# EAGLE design TSOC_CYBLE_R1_0 (EAGLE 6.6.0)
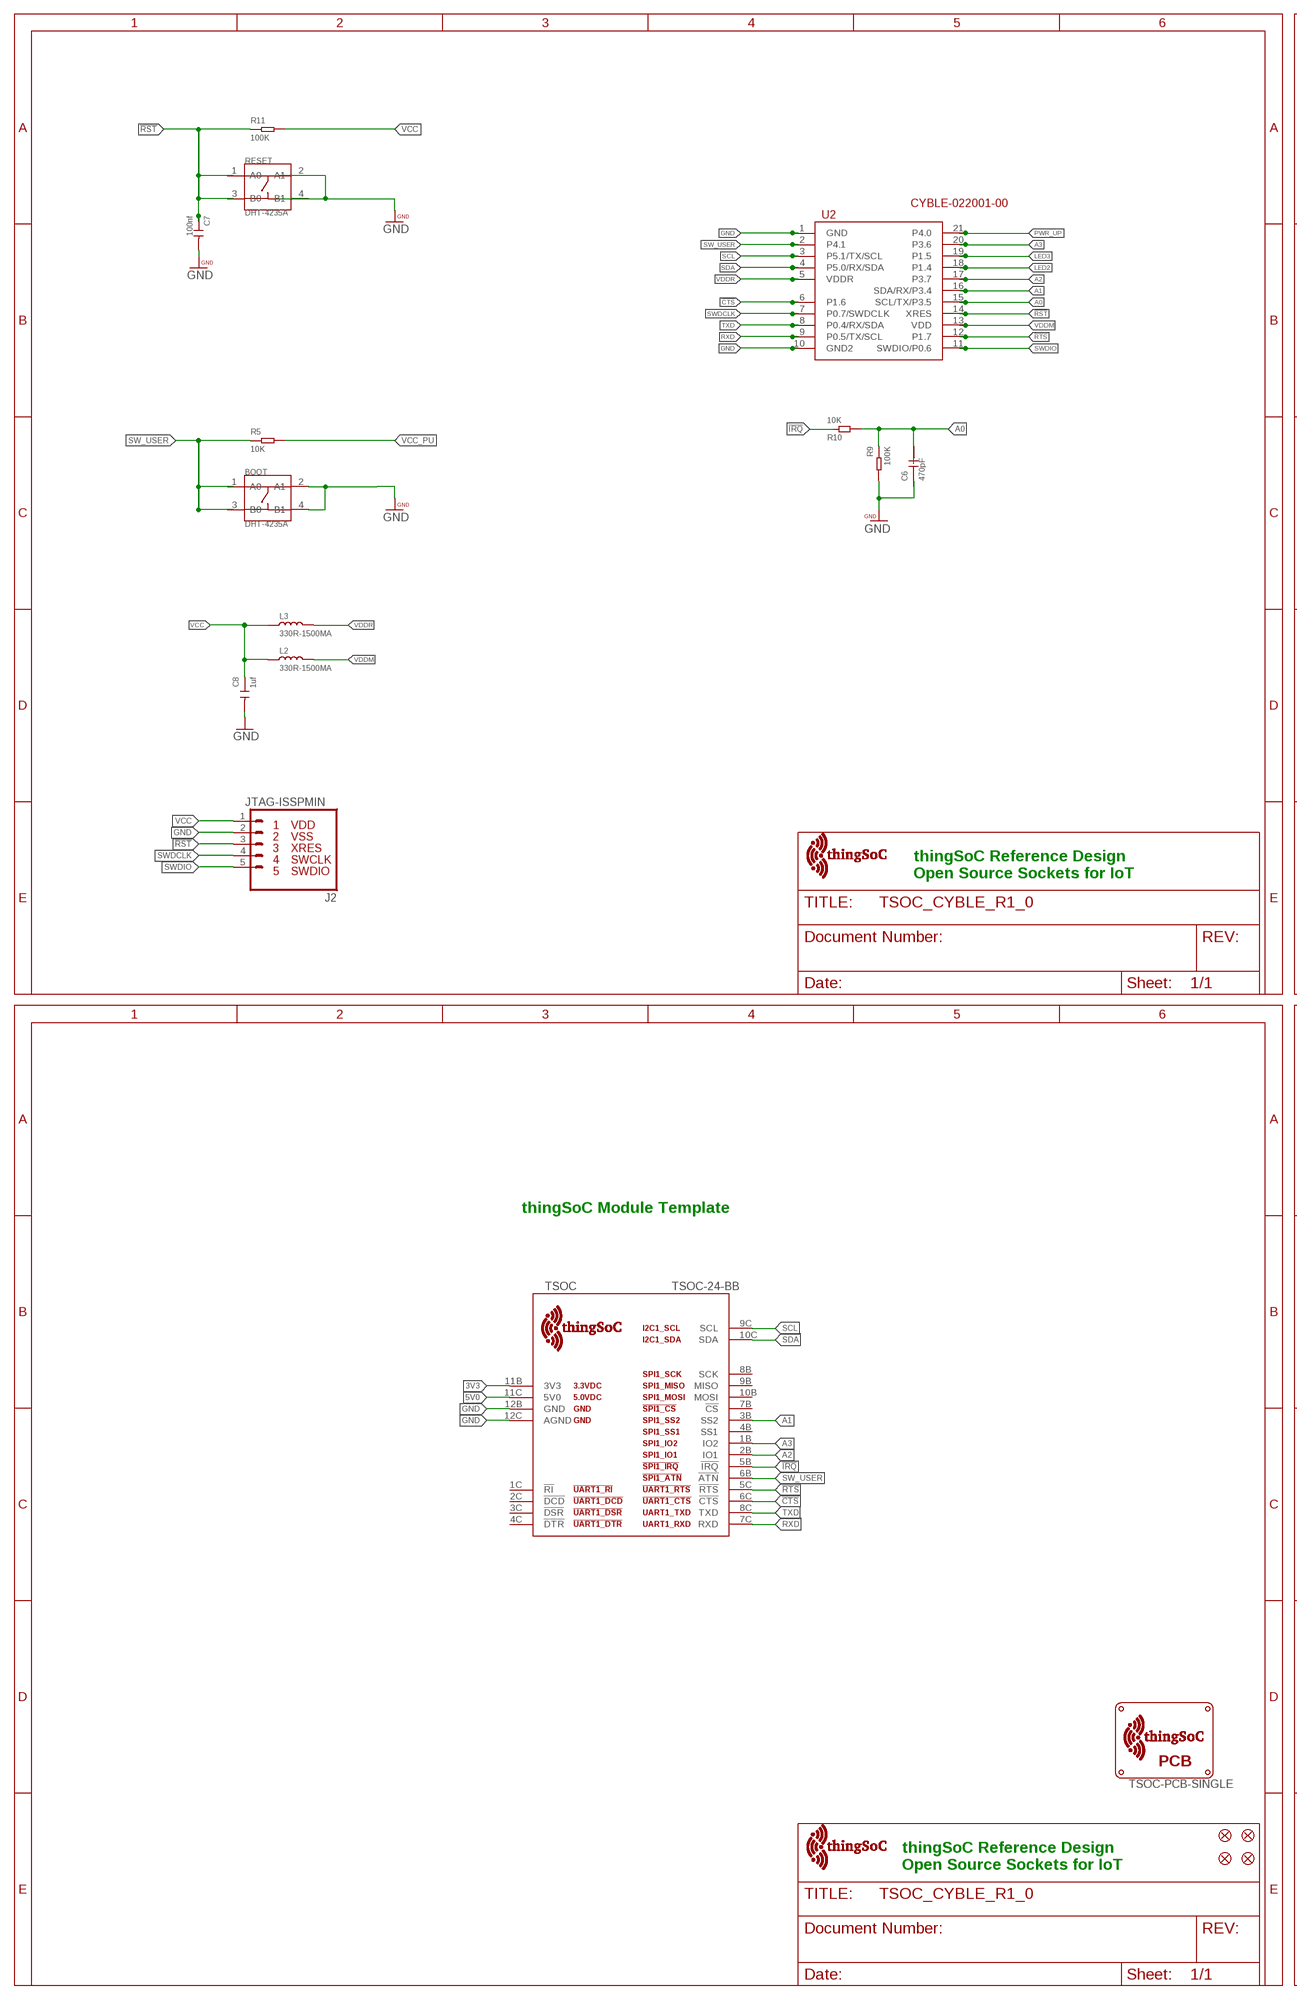
[diagram p0: schematic, sheet 1, part 1 of 2]
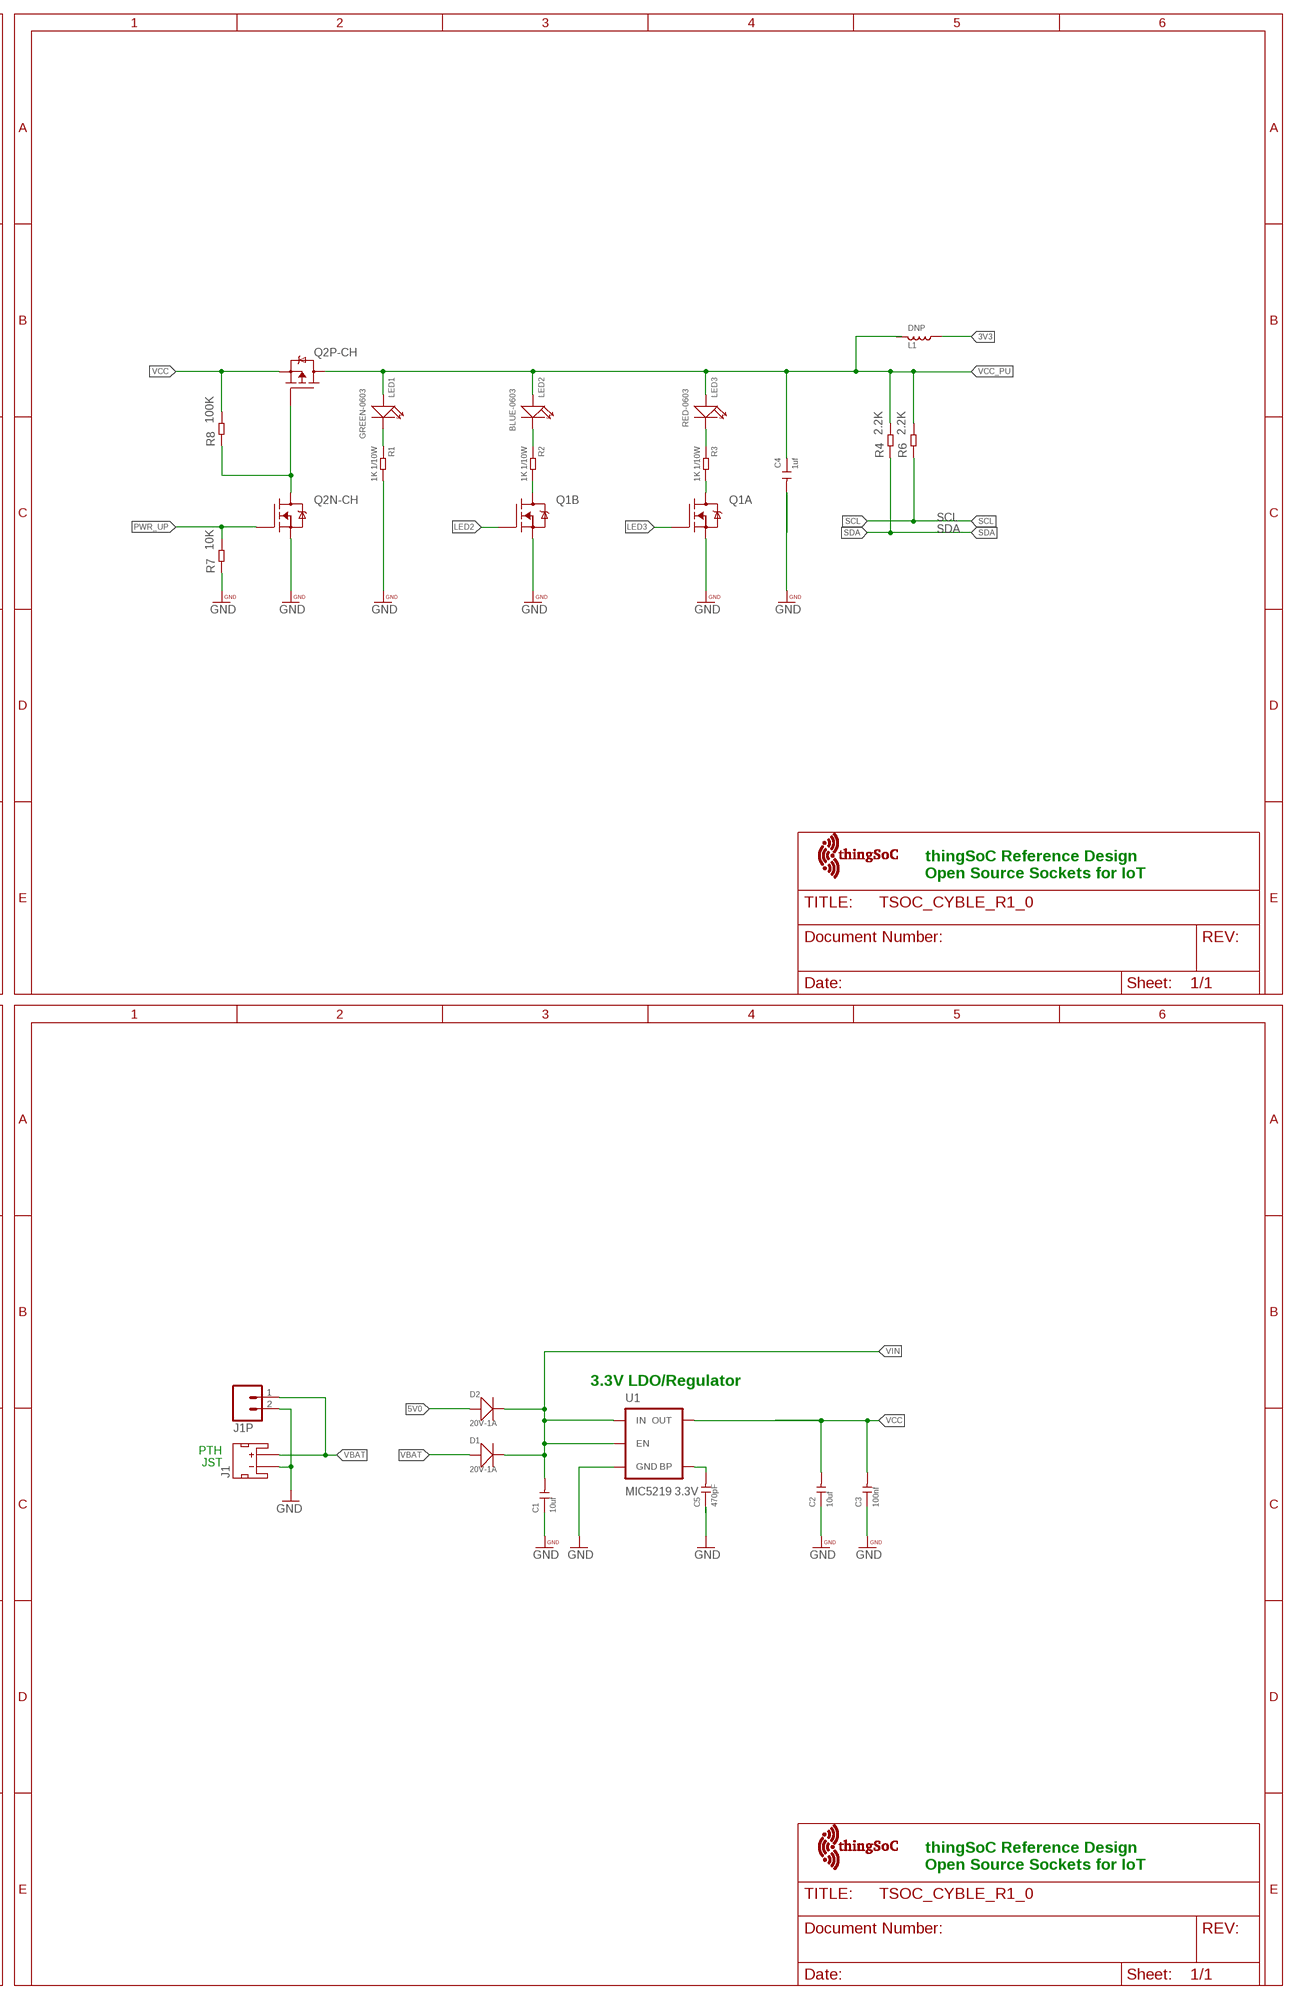
[diagram p1: schematic, sheet 1, part 2 of 2]

## Parts
$$U$1  TSOC-LOGO-MED  [TSOC-LOGO-MED]
$$U$2  TSOC-LOGO-MED  [TSOC-LOGO-MED]
BOOT  DHT-4235A  SMD-BUTTON-TOP-DHT-4235A(4P-4.2X3.2MM)  [SW4-SMD-4.2X3.2X2.5MM]
C1  10uf  CERAMIC-10UF-25V-10%-X5R(1206)  [C1206]
C2  10uf  CERAMIC-10UF-25V-10%-X5R(1206)  [C1206]
C3  100nf  CERAMIC-100NF-50V-10%-X7R(0603)  [C0603]
C4  1uf  CERAMIC-1UF-25V-10%-X7R(0603)  [C0603]
C5  470pF  CERAMIC-100NF-50V-10%-X7R(0603)  [C0603]
C6  470pF  CERAMIC-100NF-50V-10%-X7R(0603)  [C0603]
C7  100nf  CERAMIC-100NF-50V-10%-X7R(0603)  [C0603]
C8  1uf  CERAMIC-1UF-25V-10%-X7R(0603)  [C0603]
D1  20V-1A  SMD-DIODE-SCHOTTKY-20V-1A(SOD-123)  [SOD-123]
D2  20V-1A  SMD-DIODE-SCHOTTKY-20V-1A(SOD-123)  [SOD-123]
FID1  FIDUCIALUFIDUCIAL  [MICRO-FIDUCIAL]
FID2  FIDUCIALUFIDUCIAL  [MICRO-FIDUCIAL]
FID3  FIDUCIALUFIDUCIAL  [MICRO-FIDUCIAL]
FID4  FIDUCIALUFIDUCIAL  [MICRO-FIDUCIAL]
J1  JST_2MM_MALE  [JST-2-SMD]
J1P  M02-JST-2-PTH-NO_SILK  [JST-2-PTH-NS]
J2  JTAG-ISSPMIN  [PSOC_JTAG_MINSILK]
L1  DNP  SMD-FERRITE-CHIP-120-OHM-500MA(0603)  [L0603]
L2  330R-1500MA  SMD-FERRITE-BEAD-330R-1500MA(0805)'0805'  [L0805]
L3  330R-1500MA  SMD-FERRITE-BEAD-330R-1500MA(0805)'0805'  [L0805]
LED1  GREEN-0603  SMD-LED-CLEAR-GREEN(0603)  [LED-0603]
LED2  BLUE-0603  SMD-LED-CLEAR-GREEN(0603)  [LED-0603]
LED3  RED-0603  LED-SMD-RED-DIFFUSED(0603)  [LED-0603]
PCB  TSOC-PCB-SINGLE  [TSOC-BB-BRD-DIM]
Q1  FDG1024NZ  [SOT95P280X110-6N]
Q2  FDC6420C  [SOT95P280X110-6N]
R1  1K 1/10W  SMD-RES-1K-5%-1/10W(0603)  [R0603]
R2  1K 1/10W  SMD-RES-1K-5%-1/10W(0603)  [R0603]
R3  1K 1/10W  SMD-RES-1K-5%-1/10W(0603)  [R0603]
R4  2.2K  SMD-RES-2.2K-5%-1/10W(0603)  [R0603]
R5  10K  SMD-RES-10K-1%-1/10W(0603)  [R0603]
R6  2.2K  SMD-RES-2.2K-5%-1/10W(0603)  [R0603]
R7  10K  SMD-RES-10K-1%-1/10W(0603)  [R0603]
R8  100K  SMD-RES-10K-1%-1/10W(0603)  [R0603]
R9  100K  SMD-RES-100K-1%-1/10W(0603)  [R0603]
R10  10K  SMD-RES-100K-1%-1/10W(0603)  [R0603]
R11  100K  SMD-RES-10K-1%-1/10W(0603)  [R0603]
RESET  DHT-4235A  SMD-BUTTON-TOP-DHT-4235A(4P-4.2X3.2MM)  [SW4-SMD-4.2X3.2X2.5MM]
TSOC  TSOC-24-BB  [TSOC-BB-S24]
U1  MIC5219 3.3V  V_REG_MIC52193.3V  [SOT23-5]
U2  CYBLE-022001-00  [PROC-BLE-10MM-21]
U$100  TSOC-LOGO-MED  [TSOC-LOGO-MED]
U$101  TSOC-LOGO-MED  [TSOC-LOGO-MED]

## Nets
3V3: L1.2 TSOC.11B(3V3)
5V0: D2.+ TSOC.11C(5V0)
!CTS: TSOC.6C(!CTS) U2.6(P1.6)
!IRQ: R10.1 TSOC.5B(!IRQ)
!RST: C7.1 J2.3 R11.1 RESET.1(A0) RESET.3(B0) U2.14(XRES)
!RTS: TSOC.5C(!RTS) U2.12(P1.7)
A0: C6.2 R9.1 R10.2 U2.15(SCL/TX/P3.5)
A1: TSOC.3B(SS2) U2.16(SDA/RX/P3.4)
A2: TSOC.2B(IO1) U2.17(P3.7)
A3: TSOC.1B(IO2) U2.20(P3.6)
BYPASS1: C5.2 U1.4(BP)
GATE: Q2.3(P-CH:G) Q2.6(N-CH:D) R8.1
GND: BOOT.2(A1) BOOT.4(B1) C1.1 C2.1 C3.1 C4.2 C5.1 C6.1 C7.2 C8.2 J1.1(-) J1P.2 J2.2 Q1.1(A:S) Q1.4(B:S) Q2.5(N-CH:S) R1.2 R7.1 R9.2 RESET.2(A1) RESET.4(B1) TSOC.12B(GND) TSOC.12C(AGND) U1.2(GND) U2.1(GND) U2.10(GND2)
L2: Q1.3(B:D) R2.2
L3: Q1.6(A:D) R3.2
LD1: LED1.- R1.1
LD2: LED2.- R2.1
LD3: LED3.- R3.1
LED2: Q1.5(B:G) U2.18(P1.4)
LED3: Q1.2(A:G) U2.19(P1.5)
PWR_UP: Q2.1(N-CH:G) R7.2 U2.21(P4.0)
RXD: TSOC.7C(RXD) U2.9(P0.5/TX/SCL)
SCL: R6.1 TSOC.9C(SCL) U2.3(P5.1/TX/SCL)
SDA: R4.1 TSOC.10C(SDA) U2.4(P5.0/RX/SDA)
SW_USER: BOOT.1(A0) BOOT.3(B0) R5.1 TSOC.6B(!ATN) U2.2(P4.1)
SWDCLK: J2.4 U2.7(P0.7/SWDCLK)
SWDIO: J2.5 U2.11(SWDIO/P0.6)
TXD: TSOC.8C(TXD) U2.8(P0.4/RX/SDA)
VBAT: D1.+ J1.2(+) J1P.1
VCC: C2.2 C3.2 C8.1 J2.1 L2.1 L3.1 Q2.2(P-CH:S) R8.2 R11.2 U1.5(OUT)
VCC_PU: C4.1 L1.1 LED1.+ LED2.+ LED3.+ Q2.4(P-CH:D) R4.2 R5.2 R6.2
VDDM: L2.2 U2.13(VDD)
VDDR: L3.2 U2.5(VDDR)
VIN: C1.2 D1.- D2.- U1.1(IN) U1.3(EN)
Unconnected: J1.NC1(PAD1) J1.NC2(PAD2) TSOC.1C(!RI) TSOC.2C(!DCD) TSOC.3C(!DSR) TSOC.4B(SS1) TSOC.4C(!DTR) TSOC.7B(!CS) TSOC.8B(SCK) TSOC.9B(MISO) TSOC.10B(MOSI)

## Notes on the sheet
- thingSoC Reference Design
  Open Source Sockets for IoT
- thingSoC Reference Design
  Open Source Sockets for IoT
- thingSoC Module Template
- 3.3V LDO/Regulator
- PTH
   JST
- thingSoC Reference Design
  Open Source Sockets for IoT
- thingSoC Reference Design
  Open Source Sockets for IoT

## Library data of the parts
$$U$1 $$U$2 U$100 U$101 = thingSoC:TSOC-LOGO: thingSoC Logo Source LBR : http://www.thingsoc.com Github : https://github.com/thingsoc License : http://creativecommons.org/licenses/by-sa/4.0/ (Creative Commons 4.0) THIS SOFTWARE IS PROVIDED BY THE CONTRIBUTORS "AS IS" AND WITHOUT ANY EXPRESS OR IMPLIED WARRANTIES, INCLUDING, BUT NOT LIMITED TO, THE IMPLIED WARRANTIES OF MERCHANTABILITY AND FITNESS FOR A PARTICULAR PURPOSE ARE DISCLAIMED. IN NO EVENT SHALL THE COPYRIGHT OWNER OR CONTRIBUTORS BE LIABLE FOR ANY DIRECT, INDIRECT, INCIDENTAL, SPECIAL, EXEMPLARY, OR CONSEQUENTIAL DAMAGES (INCLUDING, BUT NOT LIMITED TO, PROCUREMENT OF SUBSTITUTE GOODS OR SERVICES; LOSS OF USE, DATA, OR PROFITS; OR BUSINESS INTERRUPTION) HOWEVER CAUSED AND ON ANY THEORY OF LIABILITY, WHETHER IN CONTRACT, STRICT LIABILITY, OR TORT (INCLUDING NEGLIGENCE OR OTHERWISE) ARISING IN ANY WAY OUT OF THE USE OF THIS SOFTWARE, EVEN IF ADVISED OF THE POSSIBILITY OF SUCH DAMAGE.
BOOT RESET = TSOC_GROVEY_WIFI:SMD-BUTTON-TOP-DHT-4235A(4P-4.2X3.2MM): 311020045; MPN: DHT-4235A
C1 C2 = Seeed-Capacitor-2016:CERAMIC-10UF-25V-10%-X5R(1206): 302010181; MPN: CC1206KKX5R8BB106
C3 C7 = Seeed-Capacitor-2016:CERAMIC-100NF-50V-10%-X7R(0603): 302010138; MPN: CC0603KRX7R9BB104
C4 C8 = Seeed-Capacitor-2016:CERAMIC-1UF-25V-10%-X7R(0603): 302010139; MPN: CC0603KRX7R8BB105
C5 C6 = Seeed-Capacitor-2016:CERAMIC-100NF-50V-10%-X7R(0603): 302010138; MPN: CC0603KRX7R9BB104; VALUE: 100nf
D1 D2 = Seeed-Diode-2016:SMD-DIODE-SCHOTTKY-20V-1A(SOD-123): 304020034; MPN: B5819W
FID1-FID4 = TSOC-ESP8266-BASE:FIDUCIAL: Fiducial Alignment Points Various fiducial points for machine vision alignment.
J1 = PatternAgents-ProtoPads:JST_2MM_MALE: Mates to single-cell LiPo batteries. CONN-11443 Now with smashable polarity marks!; BTM_NEG: -; BTM_POS: +; PROD_ID: CONN-11443; TOP_NEG: -; TOP_POS: +
J1P = TSOC-ESP8266-BASE:M02: Standard 2-pin 0.1" header. Use with - straight break away headers ( PRT-00116) - right angle break away headers (PRT-00553) - swiss pins (PRT-00743) - machine pins (PRT-00117) - female headers (PRT-00115) Molex polarized connector foot print use with: PRT-08233 with associated crimp pins and housings. 2.54_SCREWTERM for use with PRT-10571. 3.5mm Screw Terminal footprints for PRT-08084 5mm Screw Terminal footprints for use with PRT-08432
J2 = PatternAgents-Cypress:JTAG-ISSP: JTAG-ISSP Programming Connector (5 Pin ISSP JTAG Connector) LBR Source: http://www.patternagents.com THIS SOFTWARE IS PROVIDED BY THE CONTRIBUTORS "AS IS" AND WITHOUT ANY EXPRESS OR IMPLIED WARRANTIES, INCLUDING, BUT NOT LIMITED TO, THE IMPLIED WARRANTIES OF MERCHANTABILITY AND FITNESS FOR A PARTICULAR PURPOSE ARE DISCLAIMED. IN NO EVENT SHALL THE COPYRIGHT OWNER OR CONTRIBUTORS BE LIABLE FOR ANY DIRECT, INDIRECT, INCIDENTAL, SPECIAL, EXEMPLARY, OR CONSEQUENTIAL DAMAGES (INCLUDING, BUT NOT LIMITED TO, PROCUREMENT OF SUBSTITUTE GOODS OR SERVICES; LOSS OF USE, DATA, OR PROFITS; OR BUSINESS INTERRUPTION) HOWEVER CAUSED AND ON ANY THEORY OF LIABILITY, WHETHER IN CONTRACT, STRICT LIABILITY, OR TORT (INCLUDING NEGLIGENCE OR OTHERWISE) ARISING IN ANY WAY OUT OF THE USE OF THIS SOFTWARE, EVEN IF ADVISED OF THE POSSIBILITY OF SUCH DAMAGE.
L1 = Seeed-Inductor-2016:SMD-FERRITE-CHIP-120-OHM-500MA(0603): 303030001; MPN: BLM18AG121SN1D; VALUE: 120OHM-500MA
L2 L3 = Seeed-Inductor-2016:SMD-FERRITE-BEAD-330R-1500MA(0805): 303030006; MPN: BLM21PG331SN1D
LED1 = Seeed-LED-2016:SMD-LED-CLEAR-GREEN(0603): 304090043; MPN: 19-217-G7C-AN1P2-3T
LED2 = Seeed-LED-2016:SMD-LED-CLEAR-GREEN(0603): 304090043; MPN: 19-217-G7C-AN1P2-3T; VALUE: GREEN-0603
LED3 = Seeed-LED-2016:LED-SMD-RED-DIFFUSED(0603): 304090042; MPN: 19-217-R6C-AL1M2VY-3T
PCB = thingSoC:TSOC-PCB: thingSoC PCB Outlines Boards Outlines for Standard Sizes (in the DImension Layer) (Registration marks in the tDocu layer - make sure to turn on tDocu/bDocu) Source LBR : http://www.thingsoc.com Github : https://github.com/thingsoc License : http://creativecommons.org/licenses/by-sa/4.0/ (Creative Commons 4.0) THIS SOFTWARE IS PROVIDED BY THE CONTRIBUTORS "AS IS" AND WITHOUT ANY EXPRESS OR IMPLIED WARRANTIES, INCLUDING, BUT NOT LIMITED TO, THE IMPLIED WARRANTIES OF MERCHANTABILITY AND FITNESS FOR A PARTICULAR PURPOSE ARE DISCLAIMED. IN NO EVENT SHALL THE COPYRIGHT OWNER OR CONTRIBUTORS BE LIABLE FOR ANY DIRECT, INDIRECT, INCIDENTAL, SPECIAL, EXEMPLARY, OR CONSEQUENTIAL DAMAGES (INCLUDING, BUT NOT LIMITED TO, PROCUREMENT OF SUBSTITUTE GOODS OR SERVICES; LOSS OF USE, DATA, OR PROFITS; OR BUSINESS INTERRUPTION) HOWEVER CAUSED AND ON ANY THEORY OF LIABILITY, WHETHER IN CONTRACT, STRICT LIABILITY, OR TORT (INCLUDING NEGLIGENCE OR OTHERWISE) ARISING IN ANY WAY OUT OF THE USE OF THIS SOFTWARE, EVEN IF ADVISED OF THE POSSIBILITY OF SUCH DAMAGE.
Q1 = PatternAgents-Fairchild:FDG1024NZ: FDG1024NZ Dual N-Channel PowerTrench® MOSFET 20 V, 1.2 A, 175 mΩ
Q2 = PatternAgents-Fairchild:FDC6420C: N and P Channel Power Trench MOSFETs
R1-R3 = Seeed-Resistor-2016:SMD-RES-1K-5%-1/10W(0603): 301010291; MPN: RC0603JR-071KL
R4 R6 = Seeed-Resistor-2016:SMD-RES-2.2K-5%-1/10W(0603): 301010124; MPN: RC0603JR-072K2L
R5 R7 = Seeed-Resistor-2016:SMD-RES-10K-1%-1/10W(0603): 301010299; MPN: RC0603FR-0710KL
R8 R11 = Seeed-Resistor-2016:SMD-RES-10K-1%-1/10W(0603): 301010299; MPN: RC0603FR-0710KL; VALUE: 10K
R9 = Seeed-Resistor-2016:SMD-RES-100K-1%-1/10W(0603): 301010196; MPN: RC0603FR-07100KL
R10 = Seeed-Resistor-2016:SMD-RES-100K-1%-1/10W(0603): 301010196; MPN: RC0603FR-07100KL; VALUE: 100K
TSOC = thingSoC:TSOC-24: thingSoC Twenty-Four(24) Pin Socket Source LBR : http://www.thingsoc.com Github : https://github.com/thingsoc License : http://creativecommons.org/licenses/by-sa/4.0/ (Creative Commons 4.0) THIS SOFTWARE IS PROVIDED BY THE CONTRIBUTORS "AS IS" AND WITHOUT ANY EXPRESS OR IMPLIED WARRANTIES, INCLUDING, BUT NOT LIMITED TO, THE IMPLIED WARRANTIES OF MERCHANTABILITY AND FITNESS FOR A PARTICULAR PURPOSE ARE DISCLAIMED. IN NO EVENT SHALL THE COPYRIGHT OWNER OR CONTRIBUTORS BE LIABLE FOR ANY DIRECT, INDIRECT, INCIDENTAL, SPECIAL, EXEMPLARY, OR CONSEQUENTIAL DAMAGES (INCLUDING, BUT NOT LIMITED TO, PROCUREMENT OF SUBSTITUTE GOODS OR SERVICES; LOSS OF USE, DATA, OR PROFITS; OR BUSINESS INTERRUPTION) HOWEVER CAUSED AND ON ANY THEORY OF LIABILITY, WHETHER IN CONTRACT, STRICT LIABILITY, OR TORT (INCLUDING NEGLIGENCE OR OTHERWISE) ARISING IN ANY WAY OUT OF THE USE OF THIS SOFTWARE, EVEN IF ADVISED OF THE POSSIBILITY OF SUCH DAMAGE.
U1 = TSOC-ESP8266-BASE:V_REG_MIC5219: V_REG MIC5219 Standard 3.3V and 5V 500mA LDO voltage regulator in SOT-23 layout. Micrel part MIC5219. BP (by-pass) pin is used to lower output noise with 470pF cap, may be left open.; PROD_ID: VREG-09872
U2 = PatternAgents-Cypress:CYBLE-022001-00: Cypress PSoC® 4 - Programmable System on Chip, Cortex-M0 Based , Bluetooth Radio Module http://www.cypress.com/?mpn=CYBLE-022001-00 LBR Source: http://www.patternagents.com THIS SOFTWARE IS PROVIDED BY THE CONTRIBUTORS "AS IS" AND WITHOUT ANY EXPRESS OR IMPLIED WARRANTIES, INCLUDING, BUT NOT LIMITED TO, THE IMPLIED WARRANTIES OF MERCHANTABILITY AND FITNESS FOR A PARTICULAR PURPOSE ARE DISCLAIMED. IN NO EVENT SHALL THE COPYRIGHT OWNER OR CONTRIBUTORS BE LIABLE FOR ANY DIRECT, INDIRECT, INCIDENTAL, SPECIAL, EXEMPLARY, OR CONSEQUENTIAL DAMAGES (INCLUDING, BUT NOT LIMITED TO, PROCUREMENT OF SUBSTITUTE GOODS OR SERVICES; LOSS OF USE, DATA, OR PROFITS; OR BUSINESS INTERRUPTION) HOWEVER CAUSED AND ON ANY THEORY OF LIABILITY, WHETHER IN CONTRACT, STRICT LIABILITY, OR TORT (INCLUDING NEGLIGENCE OR OTHERWISE) ARISING IN ANY WAY OUT OF THE USE OF THIS SOFTWARE, EVEN IF ADVISED OF THE POSSIBILITY OF SUCH DAMAGE.

## Net classes
1 vcc: width 0.254 mm

## Board
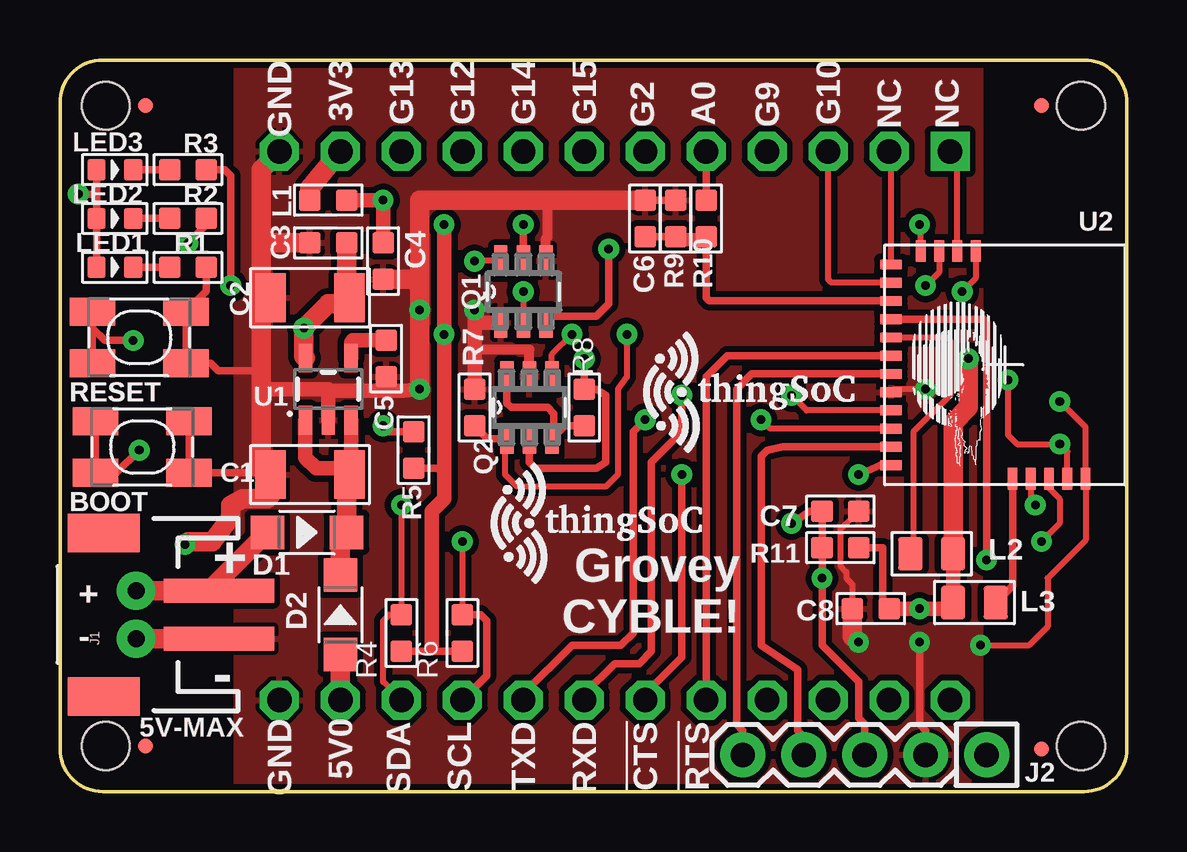
[diagram p2: board, top side]
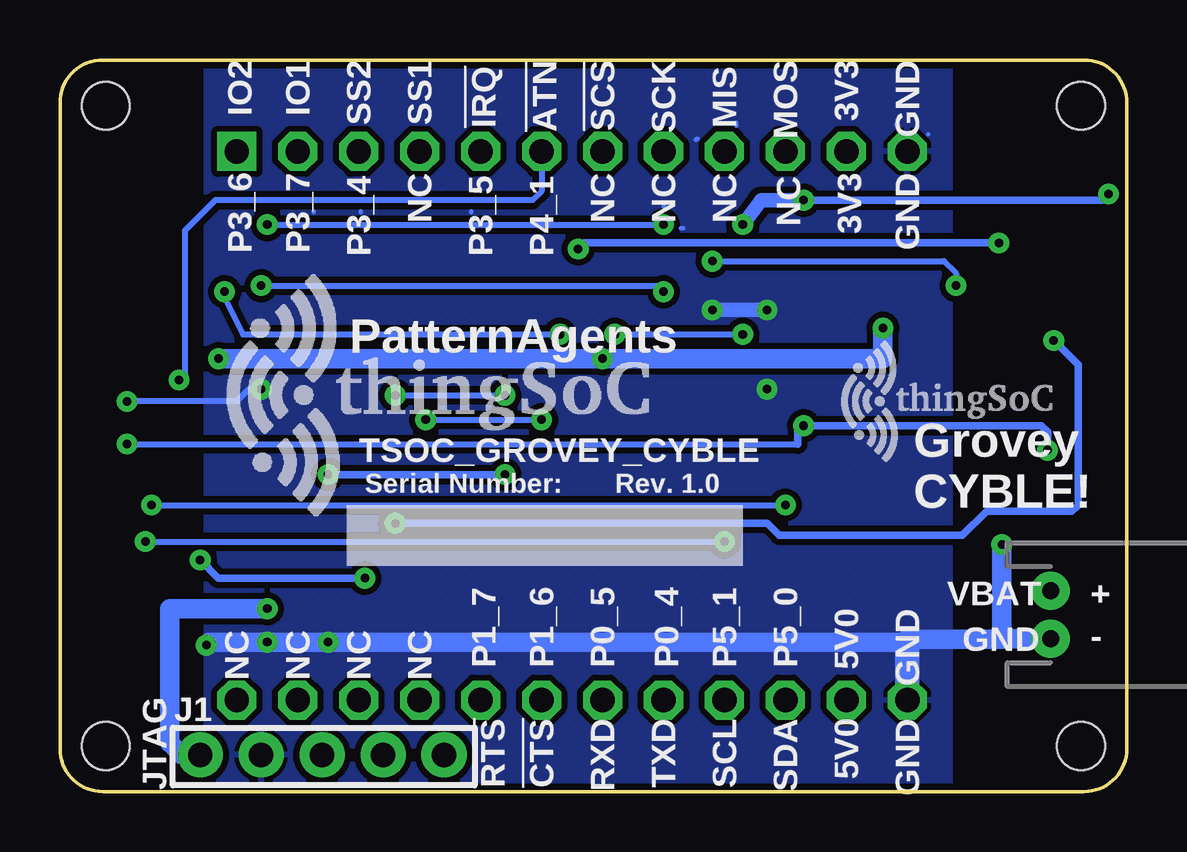
[diagram p3: board, bottom side, seen from below]

Size 44.45 x 30.48 mm. Coordinates in mm from the lower left corner, seen from the top.
Copper layers (1*16): Top 0.035mm / dielectric 1.5mm / Bottom 0.035mm
Design rules "PatternAgents_7mil": minimum track width 7mil, minimum drill 14mil, track to track 7mil, track to pad 7mil, pad to pad 7mil, via to via 7mil, smd to smd 7mil, copper to edge 7mil, drill to drill 7mil, minimum pad ring 12mil, minimum via ring 10mil, stop-mask expansion 4mil, vias tented up to drill 25mil, thermal gap 7mil

### Footprints (pad centres in the part's own frame; a part is rotated, then mirrored left to right if it is on the bottom)
SW4-SMD-4.2X3.2X2.5MM = smd 1.905 x 1.168: 1 -1.95,1.075; 2 1.95,1.075; 3 -1.95,-1.075; 4 1.95,-1.075
C1206 = smd 1.27 x 2.032: 1 -1.651,0; 2 1.651,0
C0603 = smd 0.889 x 0.889: 1 0,0.762; 2 0,-0.762
SOD-123 = smd 1.397 x 1.397: + -1.651,0; - 1.651,0
MICRO-FIDUCIAL = smd 0.635 x 0.635: 1 0,0
JST-2-SMD = smd 1 x 4.6: 1 -1,-3.7; 2 1,-3.7 | smd 1.6 x 3: NC1 -3.4,1.1; NC2 3.4,1.1
JST-2-PTH-NS = drill 0.7 pad 1.6: 1 -1,0; 2 1,0
PSOC_JTAG_MINSILK = drill 1.016 pad 1.88: 1 -5.08,0; 2 -2.54,0; 3 0,0; 4 2.54,0; 5 5.08,0
L0603 = smd 0.889 x 0.889: 1 -0.762,0; 2 0.762,0
L0805 = smd 1.016 x 1.397: 1 -0.889,0; 2 0.889,0
LED-0603 = smd 0.762 x 0.889: + -0.762,0; - 0.762,0
TSOC-BB-BRD-DIM = hole 2: 13.335,16.891; -13.335,16.891; 13.335,-23.749; -13.335,-23.749
SOT95P280X110-6N = smd 1.27 x 0.559: 1 -1.295,0.94; 2 -1.295,0; 3 -1.295,-0.94; 4 1.295,-0.94; 5 1.295,0; 6 1.295,0.94
R0603 = smd 0.889 x 0.889: 1 0,0.762; 2 0,-0.762
TSOC-BB-S24 = drill 1.016 square: 1B -11.43,11.43 | drill 1.016 octagon: 1C 11.43,11.43; 2B -11.43,8.89; 2C 11.43,8.89; 3B -11.43,6.35; 3C 11.43,6.35; 4B -11.43,3.81; 4C 11.43,3.81; 5B -11.43,1.27; 5C 11.43,1.27; 6B -11.43,-1.27; 6C 11.43,-1.27; 7B -11.43,-3.81; 7C 11.43,-3.81; 8B -11.43,-6.35; 8C 11.43,-6.35; 9B -11.43,-8.89; 9C 11.43,-8.89; 10B -11.43,-11.43; 10C 11.43,-11.43; 11B -11.43,-13.97; 11C 11.43,-13.97; 12B -11.43,-16.51; 12C 11.43,-16.51
SOT23-5 = smd 0.55 x 1.2: 1 -0.95,-1.3; 2 0,-1.3; 3 0.95,-1.3; 4 0.95,1.3; 5 -0.95,1.3
PROC-BLE-10MM-21 = smd 0.91 x 0.41: 1 4.745,3.36; 2 4.745,2.6; 3 4.745,1.84; 4 4.745,1.08; 5 4.745,0.32; 18 -4.745,-3.5; 19 -4.745,-2.74; 20 -4.745,-1.98; 21 -4.745,-1.22 | smd 0.41 x 0.91: 6 4.18,-4.745; 7 3.42,-4.745; 8 2.66,-4.745; 9 1.9,-4.745; 10 1.14,-4.745; 11 0.38,-4.745; 12 -0.38,-4.745; 13 -1.14,-4.745; 14 -1.9,-4.745; 15 -2.66,-4.745; 16 -3.42,-4.745; 17 -4.18,-4.745

### Placement (x,y rotation side)
$$U$1  19.56,11.18 0 top
$$U$2  25.91,16.64 0 top
BOOT  3.43,14.35 0 top
C1  10.41,13.21 0 top
C2  10.41,20.57 0 top
C3  11.18,22.86 90 top
C4  13.46,22.1 0 top
C5  13.59,18.03 180 top
C6  24.38,23.88 0 top
C7  32.51,11.68 90 top
C8  33.78,7.62 270 top
D1  10.29,10.79 0 top
D2  11.68,7.37 90 top
FID1  3.56,1.91 0 top
FID2  3.56,28.57 0 top
FID3  40.89,1.78 0 top
FID4  40.89,28.57 0 top
J1  2.92,7.37 90 top
J1P  3.17,7.37 270 bottom
J2  33.53,1.52 180 top
L1  11.18,24.64 180 top
L2  36.32,9.91 180 top
L3  38.1,7.87 0 top
LED1  2.29,21.84 0 top
LED2  2.29,23.88 0 top
LED3  2.29,25.91 0 top
PCB  25.65,15.24 270 top
Q1  19.3,20.83 90 top
Q2  19.56,16 90 top
R1  5.33,21.84 90 top
R2  5.33,23.88 90 top
R3  5.33,25.91 90 top
R4  14.22,6.6 0 top
R5  14.73,14.22 0 top
R6  16.76,6.6 0 top
R7  17.27,16 0 top
R8  21.84,16 180 top
R9  25.65,23.88 180 top
R10  26.92,23.88 0 top
R11  32.51,10.16 90 top
RESET  3.3,18.92 0 top
TSOC  25.65,15.24 270 top
U1  11.18,16.76 0 top
U2  39.37,17.78 270 top
U$100  10.29,16.26 0 bottom
U$101  10.29,16.26 0 bottom
U$102  TSOC-LOGO-LRG  [TSOC-LOGO-LRG]  34.29,16.51 0 bottom

### Tracks (layer width: path | path; a pad name or v marks a point on that pad's centre or on a via)
3V3
  Top 0.178: L1.2 10.41,25.15
  Top 0.813: 10.41,25.15 TSOC.11B
5V0
  Top 0.813: D2.+ TSOC.11C
!CTS  (via drill 0.36)
  Top 0.305: U2.6 34.17,13.6 v33.27,13.21 | TSOC.6C 24.38,4.06 25.91,5.59 v25.91,13.21
  Bottom 0.305: v33.27,13.21 v25.91,13.21
!IRQ
  Top 0.305: TSOC.5B R10.1
!RST  (via drill 0.36)
  Top 0.305: RESET.3 1.35,19.3 | 1.35,19.3 RESET.1 1.35,19.98 | J2.3 33.53,2.79 33.27,3.05 33.27,4.57 31.75,6.1 v31.75,8.89 R11.1 C7.1 31.24,11.68 v30.48,11.18 | v38.61,9.65 38.61,19.56 38.49,19.68 U2.14 | v3.05,18.8 1.86,18.8 1.35,19.3
  Bottom 0.305: v31.75,8.89 37.85,8.89 v38.61,9.65 | v30.48,11.18 14.99,11.18 14.48,10.67 6.86,10.67 5.84,11.68 2.29,11.68 2.03,11.94 2.03,17.78 v3.05,18.8
!RTS
  Top 0.305: TSOC.5C 26.92,17.27 27.81,18.16 U2.12
A0
  Top 0.305: R10.2 26.92,22.86 25.91,22.86 R9.1 | R10.2 C6.2 | U2.15 27.06,20.44 26.92,20.57 R10.2
A1
  Top 0.254: U2.16 32.14,21.2 32,21.34 TSOC.3B
A2
  Top 0.254: U2.17 34.62,26.59 TSOC.2B
A3
  Top 0.254: U2.20 37.39,26.36 TSOC.1B
BYPASS1
  Top 0.61: U1.4 12.13,18.73 12.19,18.8 C5.2
GATE
  Top 0.305: R8.1 21.03,15.24 Q2.3 20.57,14.78 20.57,15.75 20.32,16 18.8,16 18.62,16.18 Q2.6
GND  (via drill 0.36)
  Top 0.254: C7.2 32.51,10.92 32.51,9.4 32.77,9.14 32.77,8.89 33.02,8.64 C8.2 | v41.66,16.26 42.73,15.18 U2.1 42.73,10.47 41.15,8.89 41.15,6.86 40.39,6.1 v38.35,6.1 | v36.07,16.76 34.75,16.76 U2.10
  Top 0.305: R1.2 6.1,20.84 RESET.2 RESET.4 6.28,17.85 6.6,17.53 8.38,17.53 | J2.2 36.07,2.54 35.81,2.79 v35.81,6.22 | BOOT.2 BOOT.4 8.07,13.28 8.38,13.59 | R9.2 C6.1
  Top 0.406: Q1.4 20.24,23.04 20.32,23.11 20.32,24.38 20.57,24.64 | Q2.5 19.56,18.41 17.27,18.41
  Top 0.61: U1.2 11.18,16.51 | 11.18,16.51 11.18,16.76 8.64,16.76 8.38,17.02 | 11.18,16.51 11.36,16.69 13.72,16.69 | 13.72,16.69 14.3,16.69 v14.99,16.76 | C5.1 13.59,16.82 13.72,16.69 | v17.27,20.07 17.27,19.56 | 17.27,19.56 17.27,18.41 R7.1 | Q1.1 17.3,19.53 17.27,19.56
  Top 0.813: TSOC.12B 8.38,25.91 8.38,22.86 | C3.1 8.38,22.86 | 8.38,22.86 8.38,20.57 | 8.38,20.57 8.38,17.53 8.38,17.02 8.38,13.59 C1.1 8.76,12.32 8.64,12.19 7.62,12.19 7.11,11.94 7.11,11.43 6.35,10.41 5.33,10.41 | C2.1 8.38,20.57 | J1.1 J1P.2 | C8.2 33.02,6.48 v33.27,6.22 | C6.1 20.57,24.64 14.99,24.64 14.99,21.08 | 14.99,21.08 v14.99,20.07 v14.99,16.76 | C4.2 14.73,21.34 14.99,21.08
  Bottom 0.178: 27.3,24.18 27.3,24.13 | 16.28,27.74 16.28,27.86 | 18.59,23.47 18.49,23.47 | 9.88,26.54 9.88,26.49 TSOC.12B 9.17,26.14 | 8.28,27.38 | 33.88,24.18 33.88,24.13 | 31.93,24.18 31.93,24.13 | 17.88,27.2 17.96,27.16 | 19.3,24.36 19.3,24.43 | 9.52,27.74 9.61,27.79
  Bottom 0.254: v36.07,16.76 36.58,16.76 37.08,16.26 v41.66,16.26
  Bottom 0.61: v14.99,20.07 v17.27,20.07
  Bottom 0.813: 9.14,6.22 9.14,6.37 | J1P.2 5.19,6.37 5.21,6.35 | 5.21,6.35 v5.21,10.29 | 5.21,6.35 9.02,6.35 9.14,6.22 | 9.14,6.22 v33.27,6.22 v35.81,6.22 38.23,6.22 v38.35,6.1
  Bottom 1.016: 9.14,6.22 TSOC.12C
  pour Bottom (isolate 0.254, hatched): 7.37,0 7.37,30.48 38.35,30.48 38.35,0
  pour Top (isolate 0.254, hatched): 7.37,0 7.37,30.48 38.35,30.48 38.35,0
L2  (via drill 0.36)
  Top 0.305: R2.2 6.1,23.62 v5.33,22.86 | v22.86,22.61 22.86,20.32 22.35,19.81 20.52,19.81 Q1.3
  Bottom 0.305: v5.33,22.86 22.61,22.86 v22.86,22.61
L3  (via drill 0.36)
  Top 0.254: Q1.6 17.55,22.12 v17.27,22.1
  Top 0.305: R3.2 6.86,25.91 7.11,25.65 v7.11,21.08
  Bottom 0.254: v17.27,22.1 7.62,22.1 7.11,21.59 v7.11,21.08
LD1
  Top 0.305: R1.1 LED1.-
LD2
  Top 0.305: R2.1 LED2.-
LD3
  Top 0.305: R3.1 LED3.-
LED2  (via drill 0.36)
  Top 0.254: U2.18 35.87,23.57 v35.81,23.62
  Top 0.305: v19.3,23.62 Q1.5
  Bottom 0.254: v35.81,23.62 v19.3,23.62
LED3  (via drill 0.36)
  Top 0.254: U2.19 36.63,21.64 v36.07,21.08 | v19.3,20.83 Q1.2
  Bottom 0.254: v36.07,21.08 19.3,21.08 v19.3,20.83
PWR_UP  (via drill 0.36)
  Top 0.254: U2.21 38.15,21.39 v37.59,20.83 | v23.62,19.05 23.62,17.27 23.24,16.76 23.24,13.21 22.73,12.7 19.05,12.7 18.54,13.21 18.54,14.63 Q2.1
  Top 0.305: Q2.1 17.8,14.71 R7.2
  Bottom 0.254: v37.59,20.83 37.59,20.57 36.83,19.05 v23.62,19.05
RXD  (via drill 0.36)
  Top 0.254: U2.9 31.11,15.88 v30.48,16.51
  Top 0.305: TSOC.7C 21.84,4.06 23.11,5.33 24.13,5.33 24.64,5.84 24.64,13.72 25.91,14.99 v25.91,16.51
  Bottom 0.254: v30.48,16.51 v25.91,16.51
SCL  (via drill 0.36)
  Top 0.254: U2.3 41.21,12.64 41.66,12.19 41.66,11.18 v40.89,10.41 | v16.76,10.41 R6.1
  Top 0.305: R6.1 17.53,7.37 17.78,7.11 17.78,4.83 TSOC.9C
  Bottom 0.254: v40.89,10.41 v16.76,10.41
SDA  (via drill 0.36)
  Top 0.254: U2.4 40.45,12.13 v40.64,11.94 | v14.22,11.94 R4.1 13.72,7.37 13.46,7.11 13.46,4.57 TSOC.10C
  Bottom 0.254: v40.64,11.94 v14.22,11.94
SW_USER  (via drill 0.36)
  Top 0.254: U2.2 41.97,14.16 v41.66,14.48 39.88,14.48 39.5,14.86 v39.5,17.14
  Top 0.305: v3.3,14.22 2.35,13.28 BOOT.3 BOOT.1 | R5.1 13.72,14.99 v13.46,15.24
  Bottom 0.254: v41.66,14.48 13.72,14.48 | TSOC.6B 24.38,25.02 24.76,24.64 37.97,24.64 39.24,23.37 39.24,17.4 v39.5,17.14
  Bottom 0.305: v3.3,14.22 3.3,14.99 3.56,15.24 v13.46,15.24 13.72,14.99 13.72,14.48
SWDCLK
  Top 0.305: J2.4 30.99,2.29 30.73,2.54 30.73,5.08 29.21,6.1 29.21,13.97 29.46,14.22 30.11,14.36 U2.7
SWDIO
  Top 0.305: J2.5 28.45,2.54 28.19,2.79 28.19,16.76 28.83,17.4 U2.11
TXD  (via drill 0.36)
  Top 0.254: U2.8 29.58,15.12 v29.21,15.49
  Top 0.305: TSOC.8C 19.3,4.06 21.34,6.1 23.37,6.1 23.88,6.6 23.88,14.99 v24.38,15.49
  Bottom 0.254: v29.21,15.49 v24.38,15.49
VBAT
  Top 0.813: J1P.1 J1.2 6.37,8.53 D1.+
VCC  (via drill 0.36)
  Top 0.305: R11.2 34.29,10.16 34.29,7.87 C8.1 | v21.84,18.03 R8.2 22.35,16.76 22.73,16.51 22.73,13.72 22.35,13.46 19.81,13.46 19.56,13.72 Q2.2
  Top 0.61: L2.1 L3.1 37.08,7.87 36.83,7.62 v35.81,7.62 C8.1
  Top 0.813: C3.2 11.94,20.95 C2.2 11.81,20.32 11.18,20.32 v10.16,19.3 10.16,18.13 U1.5 | v37.85,18.03 37.85,16 37.21,15.37 L2.1
  Bottom 0.813: J2.1 39.37,1.52 39.88,2.03 39.88,7.62 v35.81,7.62 | v10.16,19.3 10.16,18.03 v21.84,18.03 v37.85,18.03
VCC_PU  (via drill 0.36)
  Top 0.254: Q2.4 20.5,18.21 v21.34,19.05
  Top 0.305: LED3.+ 1.52,24.89 | 1.52,24.89 LED2.+ LED1.+ | v0.76,24.89 1.52,24.89 | 15.49,5.84 15.49,6.1 | R6.2 15.49,5.84 | 15.49,5.84 R4.2 | R5.2 15.75,13.46 16,13.21
  Top 0.61: L1.1 v13.46,24.64 C4.1 | v16,23.62 v16,19.05 16,13.21 16,12.19 15.49,11.68 15.49,6.1
  Bottom 0.254: v21.34,19.05 v16,19.05
  Bottom 0.305: v13.46,24.64 1.02,24.64 v0.76,24.89
  Bottom 0.61: v13.46,24.64 15.24,24.64 v16,23.62
VDDM
  Top 0.254: U2.13 36.96,18.92 37.08,18.8 37.08,16.51 35.56,14.99 35.56,10.03 L2.2
VDDR
  Top 0.305: U2.5 39.69,8.57 L3.2
VIN
  Top 0.61: U1.3 12.13,13.27 C1.2 11.81,13.46 10.67,13.46 10.23,13.9 U1.1
  Top 0.813: D2.- 11.68,10.54 D1.- 11.94,13.08 C1.2

### Text on the board
tPlace: GND | 3V3 | G13 | G12 | G14 | G15 | G2 | A0 | G9 | G10 | NC | NC | RESET | BOOT | Grovey / CYBLE! | + | + | - | - | GND | 5V0 | SDA | SCL | TXD | RXD | !CTS | !RTS | 5V-MAX
bPlace: GND | 3V3 | MOS | MIS | SCK | !SCS | !ATN | !IRQ | SS1 | SS2 | IO1 | IO2 | GND | 3V3 | NC | NC | NC | NC | P4_1 | P3_5 | NC | P3_4 | P3_7 | P3_6 | PatternAgents | TSOC_GROVEY_CYBLE | Grovey / CYBLE! | Rev. 1.0 | Serial Number: | P5_0 | P5_1 | P0_4 | P0_5 | P1_6 | P1_7 | + | VBAT | GND | 5V0 | NC | NC | NC | NC | - | GND | J1 | JTAG | GND | 5V0 | SDA | SCL | TXD | RXD | !CTS | !RTS